# Altium schematic sheet Circuitos.SchDoc
size A4
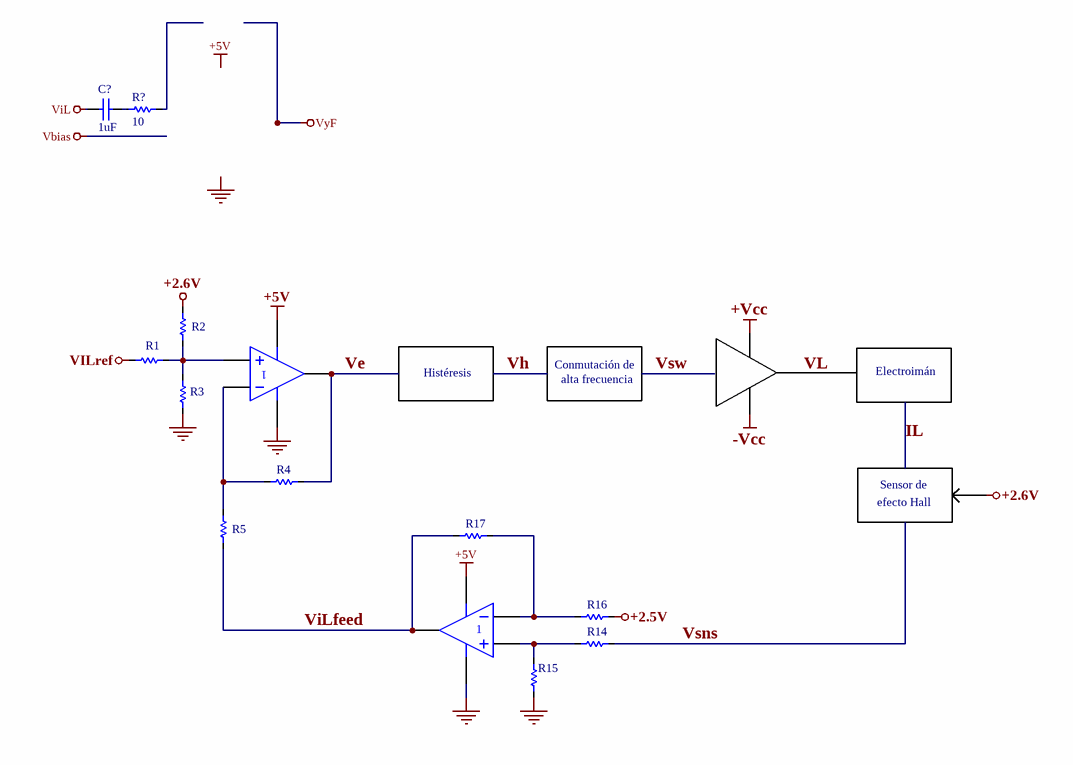
[diagram p0: Circuitos.SchDoc]

## Parts
C?  value 1uF  [0603]  (hidden comment: Capacitor)
R1  Resistencia  [0603]  (value not drawn)
R2  Resistencia  [0603]  (value not drawn)
R3  Resistencia  [0603]  (value not drawn)
R4  Resistencia  [0603]  (value not drawn)
R5  Resistencia  [0603]  (value not drawn)
R14  Resistencia  [0603]  (value not drawn)
R15  Resistencia  [0603]  (value not drawn)
R16  Resistencia  [0603]  (value not drawn)
R17  Resistencia  [0603]  (value not drawn)
R?  value 10  [0603]  (hidden comment: Resistencia)
U23  MCP664  [SOIC14]  (value not drawn)  (part A of 4)
U?  MCP664  [SOIC14]  (value not drawn)  (part A of 4)

## Nets
+2.5V: R16.2
+2.6V: R2.2
+5V: U23.11(V-) U?.4(V+)
GND: R3.1 R15.1 U23.4(V+) U?.11(V-)
ViL: C?.1
VILref: R1.2
Ve: R4.2 U23.1(OUT)
ViLfeed: R5.1 R17.1 U?.1(OUT)
Vsns: R14.2
NetC?_2: C?.2 R?.1
NetR1_1: R1.1 R2.1 R3.2 U23.3(IN+)
NetR4_1: R4.1 R5.2 U23.2(IN-)
NetR14_1: R14.1 R15.2 U?.3(IN+)
NetR16_1: R16.1 R17.2 U?.2(IN-)

Not connected (* = marked no-connect by the designer): R? 2

## Notes on the sheet
- Histéresis
- Conmutación de
- alta frecuencia
- Electroimán
- efecto Hall
- Sensor de
- Labels drawn without touching a wire or pin: +2.6V, +5V, +Vcc, -Vcc, GND, VL

## Library data of the parts
C? = Capacitor: Manufacturer: Generic Components; Class: Passive; Published: 08/06/2000; Publisher: Altium Hobart Technology Centre; SubClass: Capacitor
R1-R3 = Resistencia: Manufacturer: Generic Components; Class I: Passive; Class II: Resistor; Value: 10; Published: 8-Jun-2000; Revision: July-2002: Re-released for DXP Platform.; Publisher: Altium Limited
R4 R5 R14-R17 = Resistencia: Manufacturer: Generic Components; Class I: Passive; Class II: Resistor; Value: 25k; Published: 8-Jun-2000; Revision: July-2002: Re-released for DXP Platform.; Publisher: Altium Limited
R? = Resistencia: Manufacturer: Generic Components; Class I: Passive; Class II: Resistor; Published: 8-Jun-2000; Revision: July-2002: Re-released for DXP Platform.; Publisher: Altium Limited
U23 U? = MCP664: Part Number: MCP664-E/ST; Datasheet: https://ar.mouser.com/datasheet/2/268/20002194E-2448650.pdf